# EAGLE design suPino (EAGLE 7.2.0)
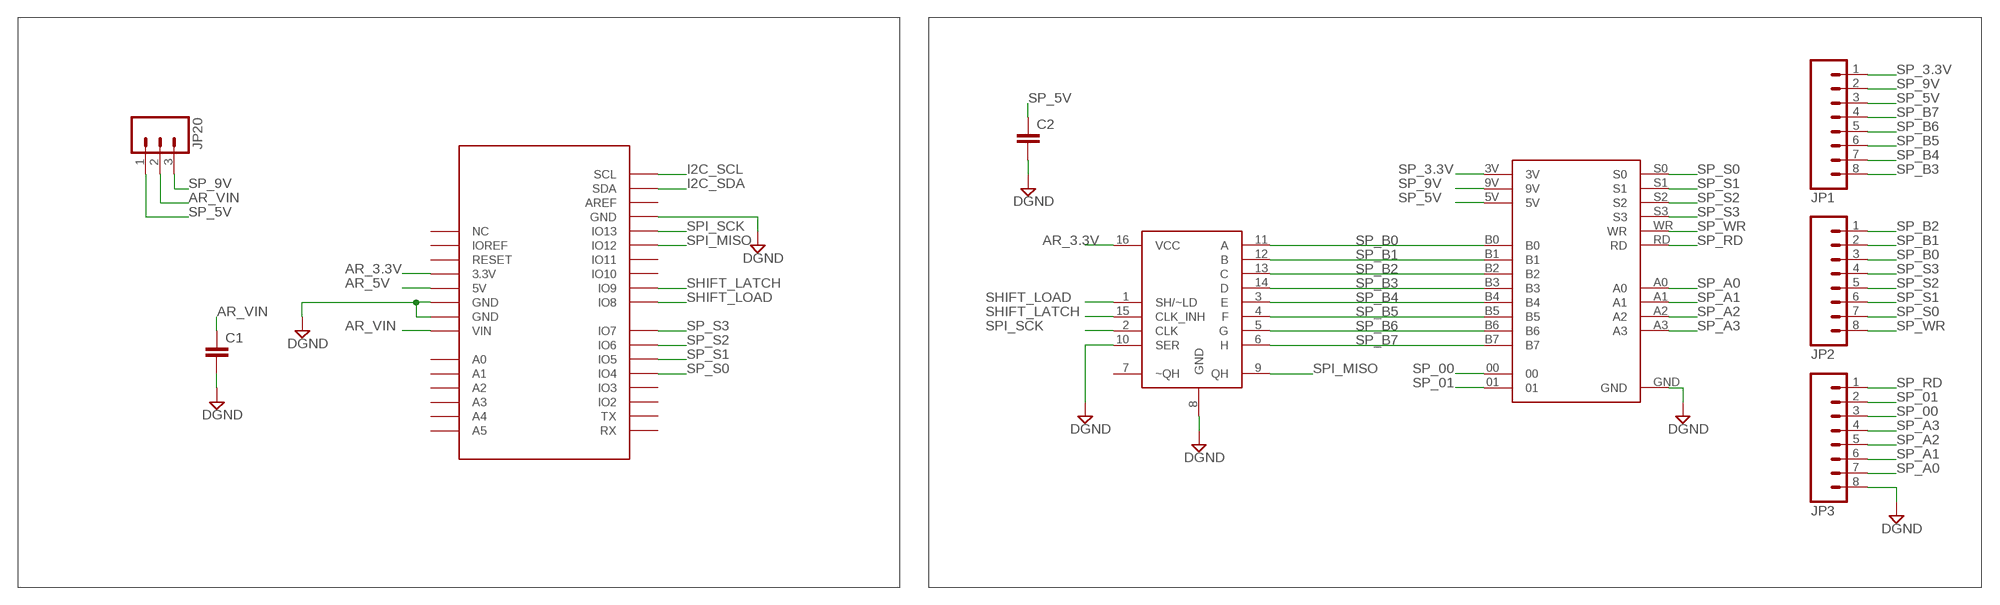
[diagram p0: schematic, sheet 1, part 1 of 2]
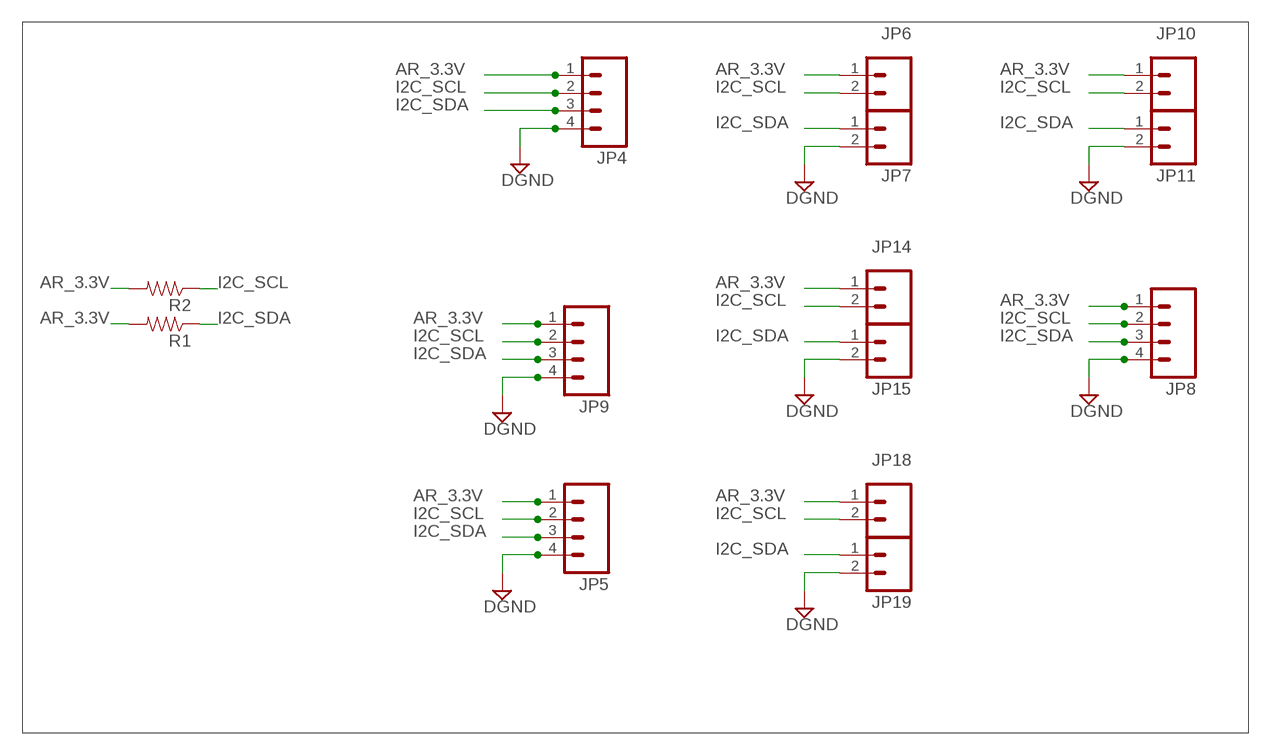
[diagram p1: schematic, sheet 1, part 2 of 2]

## Parts
C1  CAP0805  [0805]
C2  CAP0805  [0805]
JP1  M08  [1X08_ROUND]
JP2  M08  [1X08_ROUND]
JP3  M08  [1X08_ROUND]
JP4  M04PTH  [1X04]
JP5  M04PTH  [1X04]
JP6  M023.5MM  [SCREWTERMINAL-3.5MM-2]
JP7  M023.5MM  [SCREWTERMINAL-3.5MM-2]
JP8  M04PTH  [1X04]
JP9  M04PTH  [1X04]
JP10  M023.5MM  [SCREWTERMINAL-3.5MM-2]
JP11  M023.5MM  [SCREWTERMINAL-3.5MM-2]
JP14  M023.5MM  [SCREWTERMINAL-3.5MM-2]
JP15  M023.5MM  [SCREWTERMINAL-3.5MM-2]
JP18  M023.5MM  [SCREWTERMINAL-3.5MM-2]
JP19  M023.5MM  [SCREWTERMINAL-3.5MM-2]
JP20  M03PTH  [1X03]
R1  RESISTOR0805-RES  [0805]
R2  RESISTOR0805-RES  [0805]
U$1  ARDUIN_SHIELD  [ARDUNIO_SHIELD]
U$2  SUPERPRO_BOARD  [SUPERPRO_BOARD]
U$4  8B_SHIFT_REG  [TSSOP16]

## Nets
AR_3.3V: JP4.1 JP5.1 JP6.1 JP8.1 JP9.1 JP10.1 JP14.1 JP18.1 R1.2 R2.2 U$1.3.3V U$4.16(VCC)
AR_5V: U$1.5V
AR_VIN: C1.1 JP20.2 U$1.VIN
DGND: C1.2 C2.2 JP3.8 JP4.4 JP5.4 JP7.2 JP8.4 JP9.4 JP11.2 JP15.2 JP19.2 U$1.GND@0(GND) U$1.GND@1(GND) U$1.GND@2(GND) U$2.GND U$4.8(GND) U$4.10(SER)
I2C_SCL: JP4.2 JP5.2 JP6.2 JP8.2 JP9.2 JP10.2 JP14.2 JP18.2 R2.1 U$1.SCL
I2C_SDA: JP4.3 JP5.3 JP7.1 JP8.3 JP9.3 JP11.1 JP15.1 JP19.1 R1.1 U$1.SDA
SHIFT_LATCH: U$1.IO9 U$4.15(CLK_INH)
SHIFT_LOAD: U$1.IO8 U$4.1(SH/~LD)
SP_00: JP3.3 U$2.00
SP_01: JP3.2 U$2.01
SP_3.3V: JP1.1 U$2.3V
SP_5V: C2.1 JP1.3 JP20.1 U$2.5V
SP_9V: JP1.2 JP20.3 U$2.9V
SP_A0: JP3.7 U$2.A0
SP_A1: JP3.6 U$2.A1
SP_A2: JP3.5 U$2.A2
SP_A3: JP3.4 U$2.A3
SP_B0: JP2.3 U$2.B0 U$4.11(A)
SP_B1: JP2.2 U$2.B1 U$4.12(B)
SP_B2: JP2.1 U$2.B2 U$4.13(C)
SP_B3: JP1.8 U$2.B3 U$4.14(D)
SP_B4: JP1.7 U$2.B4 U$4.3(E)
SP_B5: JP1.6 U$2.B5 U$4.4(F)
SP_B6: JP1.5 U$2.B6 U$4.5(G)
SP_B7: JP1.4 U$2.B7 U$4.6(H)
SP_RD: JP3.1 U$2.RD
SP_S0: JP2.7 U$1.IO4 U$2.S0
SP_S1: JP2.6 U$1.IO5 U$2.S1
SP_S2: JP2.5 U$1.IO6 U$2.S2
SP_S3: JP2.4 U$1.IO7 U$2.S3
SP_WR: JP2.8 U$2.WR
SPI_MISO: U$1.IO12 U$4.9(QH)
SPI_SCK: U$1.IO13 U$4.2(CLK)
Unconnected: U$1.A0 U$1.A1 U$1.A2 U$1.A3 U$1.A4 U$1.A5 U$1.AREF U$1.IO2 U$1.IO3 U$1.IO10 U$1.IO11 U$1.IOREF U$1.N/C(NC) U$1.RESET U$1.RX U$1.TX U$4.7(~QH)

## Library data of the parts
C1 C2 = SparkFun-Capacitors:CAP: Capacitor Standard 0603 ceramic capacitor, and 0.1" leaded capacitor.
JP1-JP3 = SparkFun-Connectors:M08: Header 8 Standard 8-pin 0.1" header. Use with straight break away headers (SKU : PRT-00116), right angle break away headers (PRT-00553), swiss pins (PRT-00743), machine pins (PRT-00117), and female headers (PRT-00115).
JP4 JP5 JP8 JP9 = SparkFun-Connectors:M04: Header 4 Standard 4-pin 0.1" header. Use with straight break away headers (SKU : PRT-00116), right angle break away headers (PRT-00553), swiss pins (PRT-00743), machine pins (PRT-00117), and female headers (PRT-00115). Molex polarized connector foot print use with SKU : PRT-08231 with associated crimp pins and housings. 1MM SMD Version SKU: PRT-10208
JP6 JP7 JP10 JP11 JP14 JP15 JP18 JP19 = SparkFun-Connectors:M02: Standard 2-pin 0.1" header. Use with - straight break away headers ( PRT-00116) - right angle break away headers (PRT-00553) - swiss pins (PRT-00743) - machine pins (PRT-00117) - female headers (PRT-00115) Molex polarized connector foot print use with: PRT-08233 with associated crimp pins and housings. 2.54_SCREWTERM for use with PRT-10571. 3.5mm Screw Terminal footprints for PRT-08084 5mm Screw Terminal footprints for use with PRT-08432
JP20 = SparkFun-Connectors:M03: Header 3 Standard 3-pin 0.1" header. Use with straight break away headers (SKU : PRT-00116), right angle break away headers (PRT-00553), swiss pins (PRT-00743), machine pins (PRT-00117), and female headers (PRT-00115). Molex polarized connector foot print use with SKU : PRT-08232 with associated crimp pins and housings.
R1 R2 = SparkFun-Passives:RESISTOR: Resistor Basic schematic elements and footprints for 0603, 1206, and PTH resistors.
U$1 = TuansLib:ARDUIN_SHIELD
U$2 = TuansLib:SUPERPRO_BOARD
U$4 = TuansLib:8B_SHIFT_REG

## Board
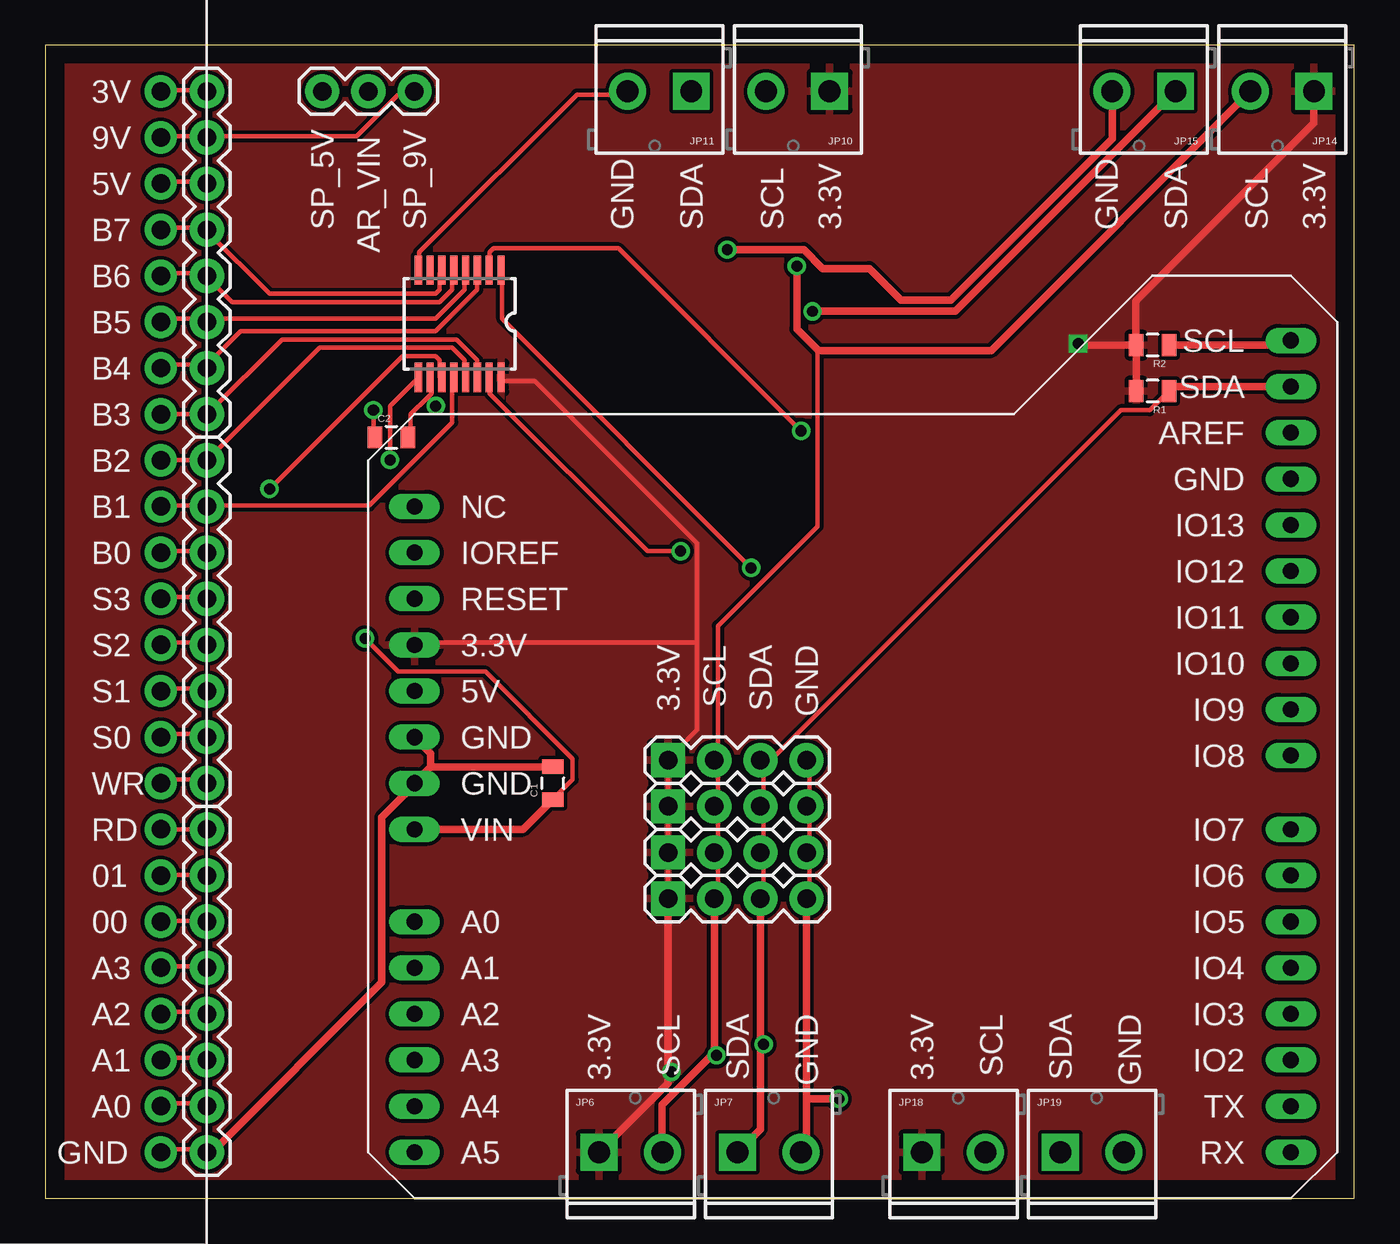
[diagram p2: board, top side]
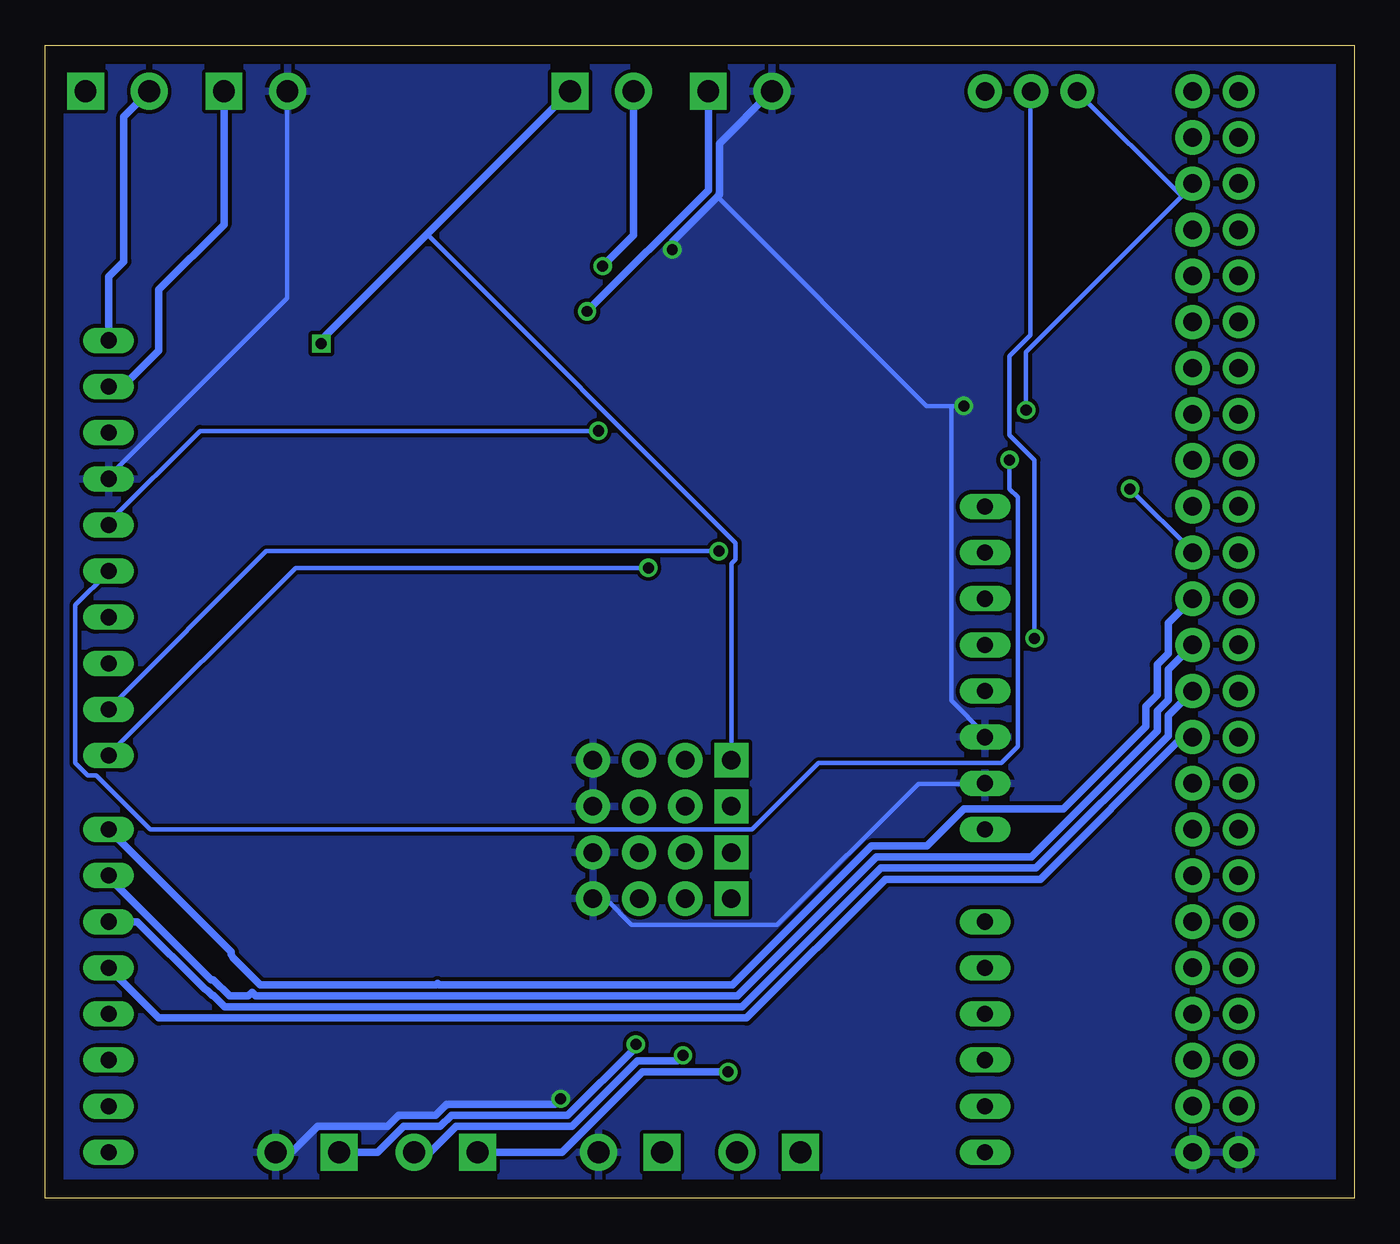
[diagram p3: board, bottom side, seen from below]

Size 72.06 x 63.49 mm. Coordinates in mm from the lower left corner, seen from the top.
Outline: 0,0 72.06,0 72.06,63.49 0,63.49 0,0
Copper layers (1*16): Top 0.035mm / dielectric 1.5mm / Bottom 0.035mm
Design rules "default": minimum track width 10mil, minimum drill 24mil, track to track 8mil, track to pad 8mil, pad to pad 8mil, via to via 8mil, smd to smd 8mil, copper to edge 40mil, drill to drill 8mil, minimum pad ring 10mil, minimum via ring 8mil, stop-mask expansion 4mil, vias tented up to drill 0mil, thermal gap 10mil

### Footprints (pad centres in the part's own frame; a part is rotated, then mirrored left to right if it is on the bottom)
0805 = smd 0.8 x 1.2: 1 -0.9,0; 2 0.9,0
1X08_ROUND = drill 1.016 pad 1.88: 1 0,0; 2 2.54,0; 3 5.08,0; 4 7.62,0; 5 10.16,0; 6 12.7,0; 7 15.24,0; 8 17.78,0
1X04 = drill 1.016 pad 1.88 square: 1 0,0 | drill 1.016 pad 1.88: 2 2.54,0; 3 5.08,0; 4 7.62,0
SCREWTERMINAL-3.5MM-2 = drill 1.2 pad 2.032 square: 1 0,0 | drill 1.2 pad 2.032: 2 3.5,0
1X03 = drill 1.016 pad 1.88: 1 0,0; 2 2.54,0; 3 5.08,0
ARDUNIO_SHIELD = drill 0.889 long: 3.3V 0,27.94; 5V 0,25.4; A0 0,12.7; A1 0,10.16; A2 0,7.62; A3 0,5.08; A4 0,2.54; A5 0,0; AREF 48.26,39.624; GND@0 0,22.86; GND@1 0,20.32; GND@2 48.26,37.084; IO2 48.26,5.08; IO3 48.26,7.62; IO4 48.26,10.16; IO5 48.26,12.7; IO6 48.26,15.24; IO7 48.26,17.78; IO8 48.26,21.844; IO9 48.26,24.384; IO10 48.26,26.924; IO11 48.26,29.464; IO12 48.26,32.004; IO13 48.26,34.544; IOREF 0,33.02; N/C 0,35.56; RESET 0,30.48; RX 48.26,0; SCL 48.26,44.704; SDA 48.26,42.164; TX 48.26,2.54; VIN 0,17.78
SUPERPRO_BOARD = drill 1.016 pad 1.778: 00 -2.54,17.78; 01 -2.54,20.32; 3V -2.54,63.5; 5V -2.54,58.42; 9V -2.54,60.96; A0 -2.54,7.62; A1 -2.54,10.16; A2 -2.54,12.7; A3 -2.54,15.24; B0 -2.54,38.1; B1 -2.54,40.64; B2 -2.54,43.18; B3 -2.54,45.72; B4 -2.54,48.26; B5 -2.54,50.8; B6 -2.54,53.34; B7 -2.54,55.88; GND -2.54,5.08; RD -2.54,22.86; S0 -2.54,27.94; S1 -2.54,30.48; S2 -2.54,33.02; S3 -2.54,35.56; WR -2.54,25.4
TSSOP16 = smd 0.4 x 1.6: 1 -2.225,-2.85; 2 -1.575,-2.85; 3 -0.925,-2.85; 4 -0.275,-2.85; 5 0.375,-2.85; 6 1.025,-2.85; 7 1.675,-2.85; 8 2.325,-2.85; 9 2.325,3.05; 10 1.675,3.05; 11 1.025,3.05; 12 0.375,3.05; 13 -0.275,3.05; 14 -0.925,3.05; 15 -1.575,3.05; 16 -2.225,3.05

### Placement (x,y rotation side)
C1  27.94,22.86 90 top
C2  19.05,41.91 0 top
JP1  8.89,60.96 270 top
JP2  8.89,40.64 270 top
JP3  8.89,20.32 270 top
JP4  34.29,19.05 0 top
JP5  34.29,16.51 0 top
JP6  30.48,2.54 0 top
JP7  38.1,2.54 0 top
JP8  34.29,21.59 0 top
JP9  34.29,24.13 0 top
JP10  43.18,60.96 180 top
JP11  35.56,60.96 180 top
JP14  69.85,60.96 180 top
JP15  62.23,60.96 180 top
JP18  48.26,2.54 0 top
JP19  55.88,2.54 0 top
JP20  15.24,60.96 0 top
R1  60.96,44.45 180 top
R2  60.96,46.99 180 top
U$1  20.32,2.54 0 top
U$2  8.89,-2.54 0 top
U$4  22.86,48.26 180 top

### Tracks (layer width: path | path; a pad name or v marks a point on that pad's centre or on a via)
AR_3.3V  (via drill 0.6)
  Top 0.254: JP5.1 JP4.1 JP8.1 JP9.1 34.29,24.21 35.89,25.81 35.89,30.61 | 35.89,30.61 35.89,36.09 26.98,45.01 25.15,45.01 U$4.16 | 35.89,30.61 20.34,30.61 U$1.3.3V
  Top 0.406: 34.29,6.96 34.29,6.35 JP6.1 | 34.29,6.96 JP5.1 | v34.47,6.96 34.29,6.96 | JP14.1 69.85,59.21 60.05,49.4 60.05,47 R2.2 | R2.2 R1.2 | v56.87,47.07 56.95,46.99 R2.2
  Bottom 0.254: JP9.1 34.29,34.95 34.06,35.18 34.06,36.09 51.05,53.09
  Bottom 0.406: JP18.1 43.61,2.54 39.19,6.96 v34.47,6.96 | JP10.1 51.05,53.09 56.87,47.27 v56.87,47.07
  pour Top: 1.07,63.07 71.88,63.07 71.88,0.15 1.22,0.15 1.22,62.99
AR_VIN  (via drill 0.61)
  Top 0.254: v17.6,30.84 19.43,29.01 24.23,29.01 29.03,24.21 29.03,23.06 28.12,22.15 C1.1
  Top 0.406: U$1.VIN 26.3,20.32 C1.1
  Bottom 0.254: v17.6,30.84 17.6,40.66 18.97,42.04 18.97,46.38 17.83,47.52 17.83,60.78 JP20.2
DGND  (via drill 0.6, 0.61)
  Top 0.254: JP9.4 42.06,23.98 42.06,21.69 JP8.4 42.06,21.46 42.06,19.18 JP4.4 42.06,18.95 42.06,16.66 JP5.4 | U$2.GND 6.4,2.72 8.69,2.72 JP3.8 | 21.03,44.09 21.26,44.32 21.26,45.01 U$4.10 | 21.03,44.09 20.12,43.18 20.12,42.04 C2.2 | U$4.8 20.57,51.18 20.57,52.09 29.26,60.78 32,60.78 JP11.2 | v21.49,43.64 21.03,44.09
  Top 0.406: 41.91,5.49 41.91,2.84 JP7.2 | 41.91,5.49 JP5.4 | 41.91,5.49 v43.69,5.49 | 21.22,23.76 U$1.GND@1 20.22,22.68 18.52,20.98 18.52,11.89 9.17,2.54 JP3.8 | 21.22,23.76 C1.2 | U$1.GND@0 21.22,24.5 21.22,23.76 | v37.54,52.25 41.76,52.25 42.8,51.21 45.36,51.21 47.12,49.45 49.86,49.45 58.75,58.34 58.75,60.96 JP15.2
  Bottom 0.254: U$1.GND@2 68.58,39.75 58.75,49.58 58.75,60.78 JP15.2 | 22.17,43.64 23.55,43.64 35.06,55.16 | 22.17,43.64 v21.49,43.64 | 22.17,43.64 22.17,27.41 20.34,25.58 U$1.GND@0 | JP5.4 41.83,16.43 41.15,16.43 39.78,15.06 31.77,15.06 24,22.84 20.34,22.84 U$1.GND@1
  Bottom 0.406: JP19.2 58.5,2.54 57.07,3.96 53.21,3.96 52.6,4.57 50.57,4.57 49.96,5.18 43.99,5.18 v43.69,5.49 | v37.54,52.25 37.54,52.68 35.06,55.16 34.95,55.27 34.95,58.09 32.08,60.96 JP11.2
  pour Bottom: 1.22,62.74 1.14,62.74 1.14,0.41 71.65,0.41 71.65,63.07 1.22,63.07
I2C_SCL  (via drill 0.6)
  Top 0.254: JP5.2 37.03,16.66 37.03,18.95 JP4.2 37.03,19.18 37.03,21.46 JP8.2 37.03,21.69 37.03,23.98 JP9.2 37.03,24.21 37.03,31.52 42.52,37.01 42.52,46.61 42.57,46.69
  Top 0.406: JP5.2 36.83,8.03 36.82,8.01 | 36.82,8.01 33.96,5.16 33.96,2.54 JP6.2 | v36.96,7.87 36.82,8.01 | R2.1 68.33,46.99 U$1.SCL | v41.38,51.33 41.38,47.88 42.57,46.69 52.08,46.69 JP14.2
  Bottom 0.406: JP18.2 50.88,2.54 49.45,3.96 43.05,3.96 39.45,7.57 37.26,7.57 v36.96,7.87 | U$1.SCL 68.58,50.75 67.74,51.59 67.74,59.57 JP14.2 | JP10.2 39.68,53.03 v41.38,51.33
I2C_SDA  (via drill 0.6)
  Top 0.254: JP5.3 39.55,16.66 39.55,18.95 JP4.3 39.55,19.18 39.55,21.46 JP8.3 39.55,21.69 39.55,23.98 JP9.3 39.55,24.21 40.01,24.21 59.21,43.41 60.81,43.41 61.72,44.32 R1.1
  Top 0.406: 39.37,8.48 39.37,3.81 JP7.1 | 39.37,8.48 JP5.3 | v39.55,8.48 39.37,8.48 | U$1.SDA 62.11,44.7 R1.1 | v42.24,48.84 50.11,48.84 JP15.1
  Bottom 0.406: JP19.1 53.77,2.54 52.35,3.96 50.32,3.96 49.71,4.57 43.31,4.57 39.55,8.33 v39.55,8.48 | JP15.1 62.23,53.62 65.81,50.04 65.81,46.69 67.79,44.7 U$1.SDA | JP11.1 35.56,55.52 v42.24,48.84
SHIFT_LATCH  (via drill 0.61)
  Top 0.254: v34.98,35.64 33.15,35.64 24.46,44.32 24.46,45.01 U$4.15
  Bottom 0.254: v34.98,35.64 59.89,35.64 68.58,26.95 U$1.IO9
SHIFT_LOAD  (via drill 0.61)
  Top 0.254: v38.86,34.72 25.15,48.44 25.15,50.95 U$4.1
  Bottom 0.254: v38.86,34.72 58.29,34.72 68.58,24.44 U$1.IO8
SP_00
  Top 0.254: U$2.00 6.4,15.29 8.69,15.29 JP3.3
SP_01
  Top 0.254: U$2.01 6.4,17.8 8.69,17.8 JP3.2
SP_3.3V
  Top 0.254: U$2.3V 6.4,61.01 8.69,61.01 JP1.1
SP_5V  (via drill 0.61)
  Top 0.254: v18.06,43.41 18.06,42.04 C2.1 | U$2.5V 6.4,55.98 8.69,55.98 JP1.3
  Bottom 0.254: v18.06,43.41 18.06,46.61 9.37,55.3 | 9.37,55.3 8.91,55.75 JP1.3 9.37,55.3 | 9.37,55.3 9.6,55.3 15.09,60.78 JP20.1
SP_9V
  Top 0.254: U$2.9V 6.4,58.5 8.69,58.5 JP1.2 8.91,58.5 17.14,58.5 19.43,60.78 20.12,60.78 JP20.3
SP_A0
  Top 0.254: U$2.A0 6.4,5.23 8.69,5.23 JP3.7
SP_A1
  Top 0.254: U$2.A1 6.4,7.75 8.69,7.75 JP3.6
SP_A2
  Top 0.254: U$2.A2 6.4,10.26 8.69,10.26 JP3.5
SP_A3
  Top 0.254: U$2.A3 6.4,12.78 8.69,12.78 JP3.4
SP_B0  (via drill 0.61)
  Top 0.254: v12.34,39.06 19.66,46.38 21.49,46.38 21.72,46.15 21.72,45.24 U$4.11 | U$2.B0 6.4,35.64 8.69,35.64 JP2.3
  Bottom 0.254: v12.34,39.06 8.91,35.64 JP2.3
SP_B1
  Top 0.254: U$4.12 22.4,45.01 22.4,42.72 17.83,38.15 8.91,38.15 JP2.2 8.69,38.15 6.4,38.15 U$2.B1
SP_B2
  Top 0.254: U$4.13 23.09,45.24 23.09,46.15 22.4,46.84 15.09,46.84 JP2.1 8.69,40.66 6.4,40.66 U$2.B2
SP_B3
  Top 0.254: U$4.14 23.77,45.24 23.77,46.15 22.63,47.3 13.03,47.3 8.91,43.18 JP1.8 U$2.B3
SP_B4
  Top 0.254: U$4.3 23.77,50.95 23.77,50.04 21.49,47.75 10.74,47.75 8.91,45.92 JP1.7 8.69,45.92 6.4,45.92 U$2.B4
SP_B5
  Top 0.254: U$4.4 23.09,50.95 23.09,50.04 21.49,48.44 8.91,48.44 JP1.6 8.69,48.44 6.4,48.44 U$2.B5
SP_B6
  Top 0.254: U$4.5 22.4,50.95 22.4,50.04 21.72,49.35 10.29,49.35 8.91,50.72 JP1.5 8.69,50.95 6.4,50.95 U$2.B6
SP_B7
  Top 0.254: U$4.6 21.72,50.95 21.72,50.04 21.49,49.81 12.34,49.81 8.91,53.24 JP1.4 8.69,53.47 6.4,53.47 U$2.B7
SP_RD
  Top 0.254: JP3.1 U$2.RD
SP_S0
  Top 0.254: U$2.S0 6.4,25.58 8.69,25.58 JP2.7
  Bottom 0.406: JP2.7 9.45,25.4 17.27,17.58 25.81,17.58 33.45,9.93 65.81,9.93 U$1.IO4
SP_S1
  Top 0.254: U$2.S1 6.4,28.09 8.69,28.09 JP2.6
  Bottom 0.406: U$1.IO5 67,15.24 63.3,11.53 63.12,11.43 62.87,11.18 62.81,11.18 62.18,10.54 33.71,10.54 26.06,18.19 17.53,18.19 10.24,25.48 10.24,26.59 JP2.6
SP_S2
  Top 0.254: U$2.S2 6.4,30.61 8.69,30.61 JP2.5
  Bottom 0.406: JP2.5 10.24,29.13 10.24,27.46 10.85,26.85 10.85,25.73 17.78,18.8 26.31,18.8 33.96,11.15 60.48,11.15 60.68,11.35 60.88,11.15 61.92,11.15 62.81,12.04 62.94,12.04 68.58,17.68 U$1.IO6
SP_S3
  Top 0.254: U$2.S3 6.4,33.12 8.69,33.12 JP2.4
  Bottom 0.406: U$1.IO7 61.82,13.56 61.82,13.44 61.72,13.26 60.22,11.76 50.55,11.76 50.47,11.84 50.39,11.76 34.21,11.76 26.57,19.41 23.52,19.41 21.49,21.44 16,21.44 11.46,25.98 11.46,27.1 10.85,27.71 10.85,29.39 10.24,30 10.24,31.67 JP2.4
SP_WR
  Top 0.254: U$2.WR 6.4,23.06 8.69,23.06 JP2.8
SPI_MISO  (via drill 0.61)
  Top 0.254: v18.97,40.66 18.97,43.64 20.34,45.01 U$4.9
  Bottom 0.254: v18.97,40.66 18.97,39.06 18.52,38.61 18.52,24.89 19.43,23.98 29.49,23.98 33.15,20.32 66.29,20.32 69.27,23.29 69.72,23.29 70.41,23.98 70.41,32.66 68.58,34.49 U$1.IO12
SPI_SCK  (via drill 0.61)
  Top 0.254: v41.6,42.27 31.55,52.32 24.69,52.32 24.46,52.09 24.46,51.18 U$4.2
  Bottom 0.254: v41.6,42.27 63.55,42.27 68.58,37.24 U$1.IO13

### Text on the board
tPlace: SP_5V | SP_9V | GND | SDA | SCL | 3.3V | GND | SDA | SCL | 3.3V | AR_VIN | 3.3V | SCL | SDA | GND | 3.3V | SCL | SDA | GND | 3.3V | SCL | SDA | GND